# EAGLE design Front_left_lamp_v5 (EAGLE 7.3.0)
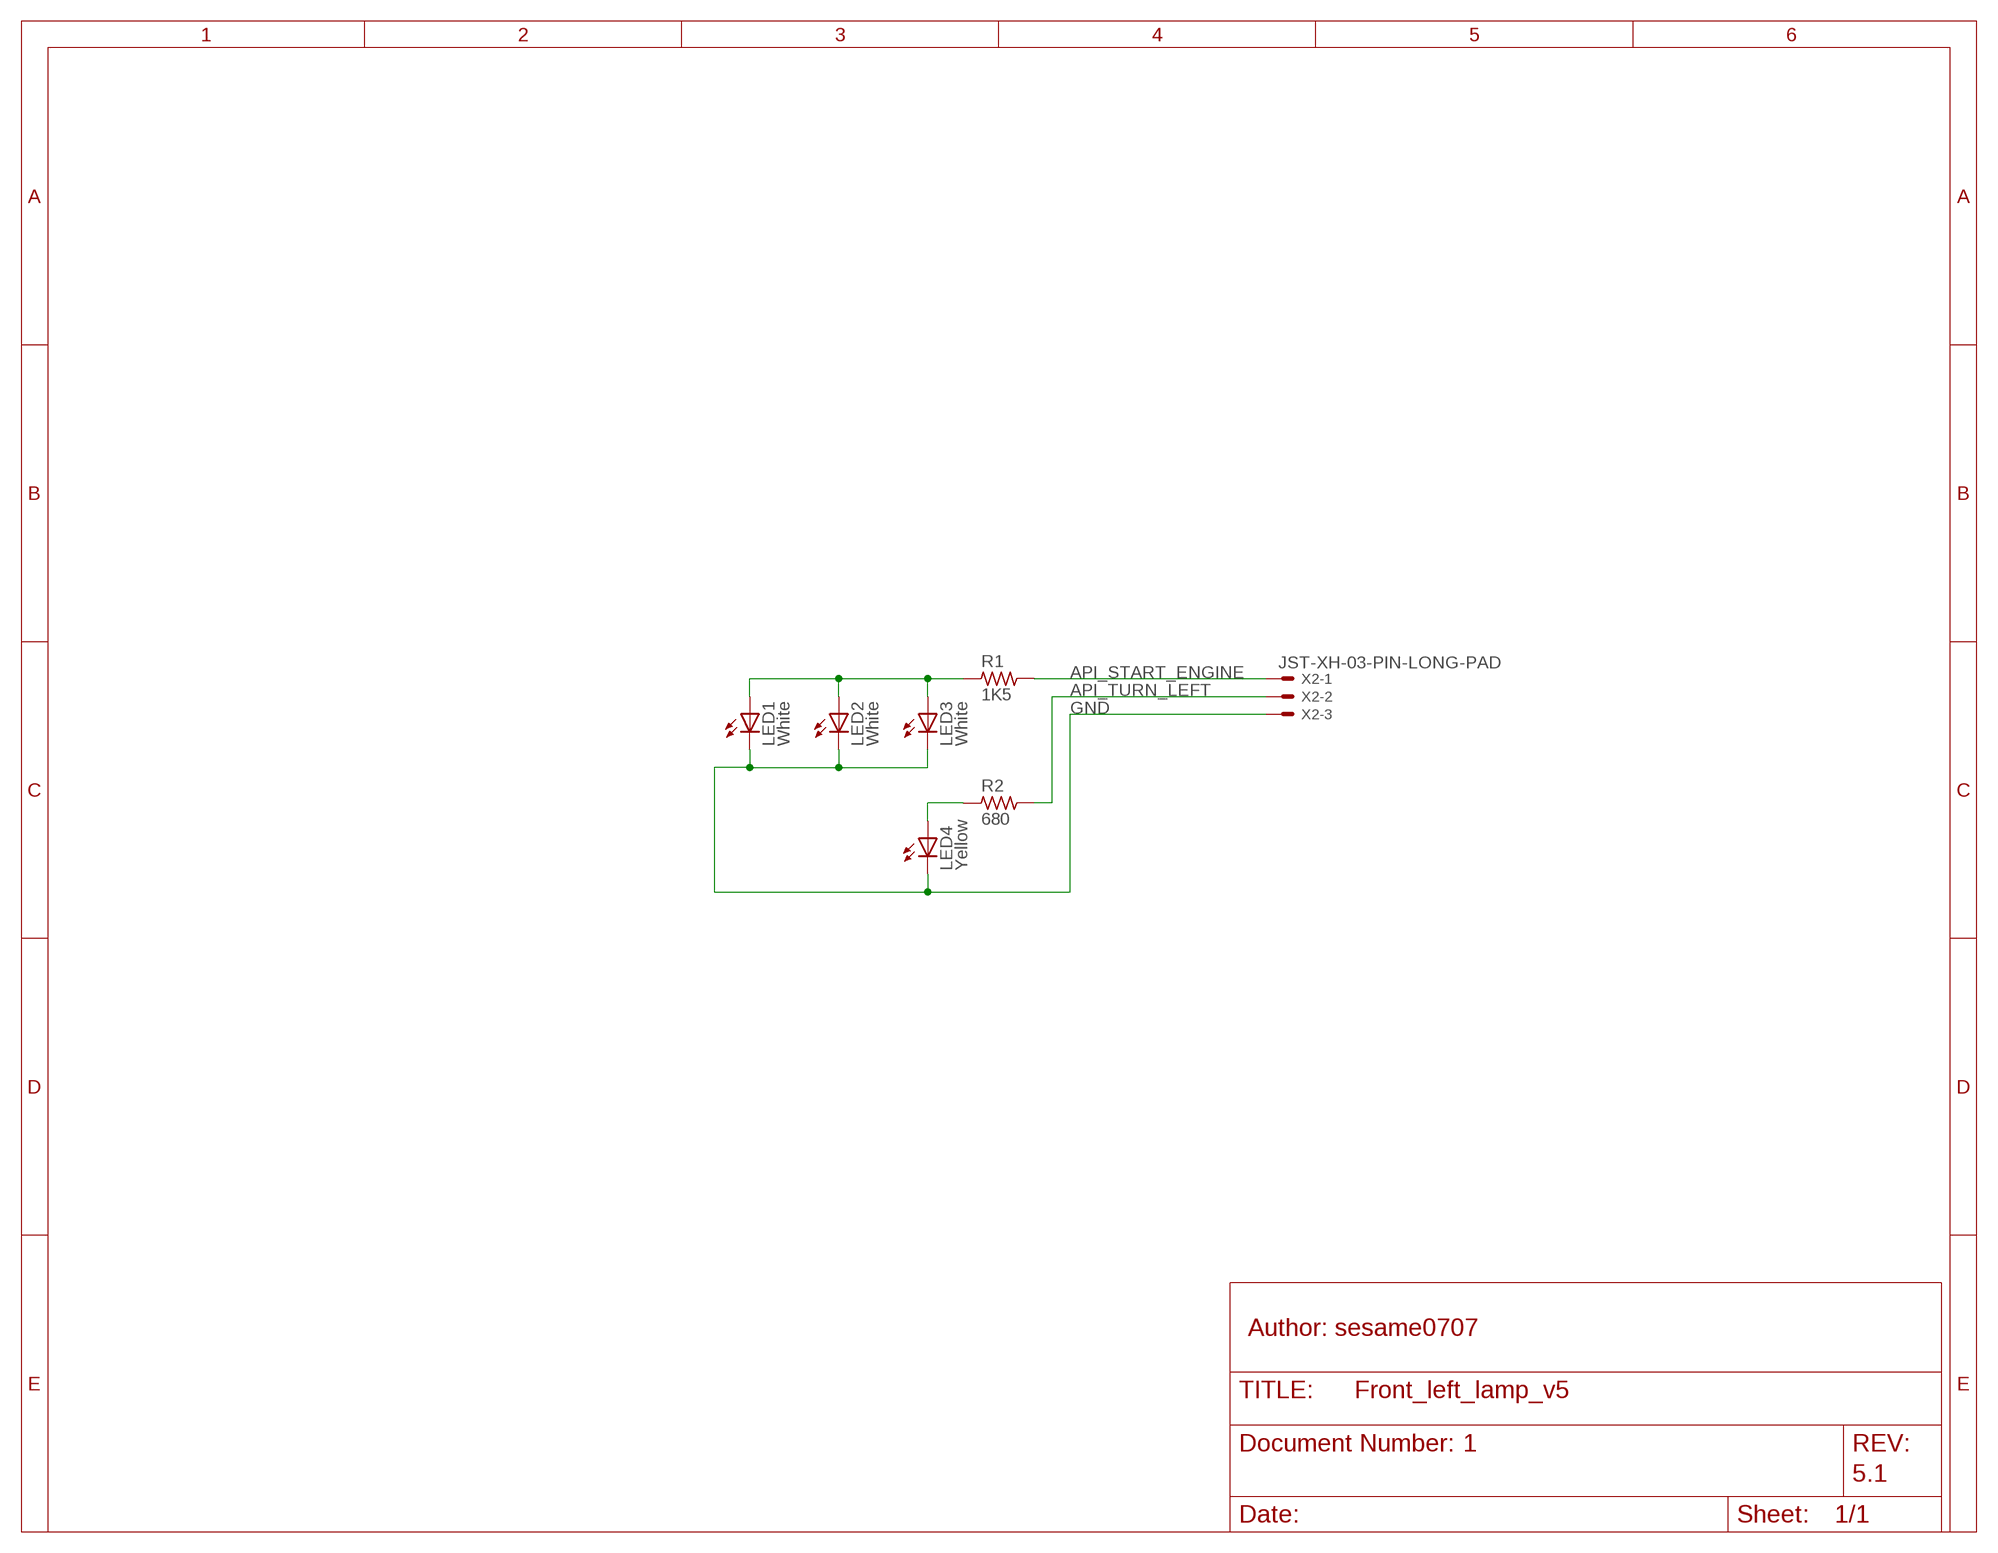
[diagram p0: schematic, sheet 1]

## Parts
LED1  White  LED5MM  [LED5MM]
LED2  White  LED5MM  [LED5MM]
LED3  White  LED5MM  [LED5MM]
LED4  Yellow  LED5MM  [LED5MM]
R1  1K5  R_1206  [R1206]
R2  680  R_1206  [R1206]
X2  JST-XH-03-PIN-LONG-PAD  [JST-XH-03-PACKAGE-LONG-PAD]

## Nets
API_START_ENGINE: LED1.A LED2.A LED3.A R1.1
API_TURN_LEFT: R2.2 X2.2
GND: LED1.K(C) LED2.K(C) LED3.K(C) LED4.K(C) X2.3
N$1: R1.2 X2.1
N$2: LED4.A R2.1

## Notes on the sheet
- Author: sesame0707
- 1
- 5.1

## Library data of the parts
LED1-LED3 = led:LED: LED OSRAM: - CHIPLED LG R971, LG N971, LY N971, LG Q971, LY Q971, LO R971, LY R971 LH N974, LH R974 LS Q976, LO Q976, LY Q976 LO Q996 - Hyper CHIPLED LW Q18S LB Q993, LB Q99A, LB R99A - SideLED LS A670, LO A670, LY A670, LG A670, LP A670 LB A673, LV A673, LT A673, LW A673 LH A674 LY A675 LS A676, LA A676, LO A676, LY A676, LW A676 LS A679, LY A679, LG A679 - Hyper Micro SIDELED® LS Y876, LA Y876, LO Y876, LY Y876 LT Y87S - SmartLED LW L88C, LW L88S LB L89C, LB L89S, LG L890 LS L89K, LO L89K, LY L89K LS L896, LA L896, LO L896, LY L896 - TOPLED LS T670, LO T670, LY T670, LG T670, LP T670 LSG T670, LSP T670, LSY T670, LOP T670, LYG T670 LG T671, LOG T671, LSG T671 LB T673, LV T673, LT T673, LW T673 LH T674 LS T676, LA T676, LO T676, LY T676, LB T676, LH T676, LSB T676, LW T676 LB T67C, LV T67C, LT T67C, LS T67K, LO T67K, LY T67K, LW E67C LS E67B, LA E67B, LO E67B, LY E67B, LB E67C, LV E67C, LT E67C LW T67C LS T679, LY T679, LG T679 LS T770, LO T770, LY T770, LG T770, LP T770 LB T773, LV T773, LT T773, LW T773 LH T774 LS E675, LA E675, LY E675, LS T675 LS T776, LA T776, LO T776, LY T776, LB T776 LHGB T686 LT T68C, LB T68C - Hyper Mini TOPLED® LB M676 - Mini TOPLED Santana® LG M470 LS M47K, LO M47K, LY M47K Source: http://www.osram.convergy.de LUXEON: - LUMILED® LXK2-PW12-R00, LXK2-PW12-S00, LXK2-PW14-U00, LXK2-PW14-V00 LXK2-PM12-R00, LXK2-PM12-S00, LXK2-PM14-U00 LXK2-PE12-Q00, LXK2-PE12-R00, LXK2-PE12-S00, LXK2-PE14-T00, LXK2-PE14-U00 LXK2-PB12-K00, LXK2-PB12-L00, LXK2-PB12-M00, LXK2-PB14-N00, LXK2-PB14-P00, LXK2-PB14-Q00 LXK2-PR12-L00, LXK2-PR12-M00, LXK2-PR14-Q00, LXK2-PR14-R00 LXK2-PD12-Q00, LXK2-PD12-R00, LXK2-PD12-S00 LXK2-PH12-R00, LXK2-PH12-S00 LXK2-PL12-P00, LXK2-PL12-Q00, LXK2-PL12-R00 Source: www.luxeon.com KINGBRIGHT: KA-3528ASYC Source: www.kingbright.com; COLOR: White; CURRENT_EMPIRICAL: 0.14 mA; MANUFACTURER: LUCKYLIGHT; MANUFACTURER_PART_NUMBER: LL-504WC2V-W2-3PD; SUPPLIER: TME; SUPPLIER_PART_NUMBER: LL-504WC2V-W2-3PD; SUPPLIER_URL: https://www.tme.eu/pl/details/ll-504wc2v-w2-3pd/diody-led-tht-okragle/luckylight/; VOLTAGE_EMPIRICAL: 2.58 V
LED4 = led:LED: LED OSRAM: - CHIPLED LG R971, LG N971, LY N971, LG Q971, LY Q971, LO R971, LY R971 LH N974, LH R974 LS Q976, LO Q976, LY Q976 LO Q996 - Hyper CHIPLED LW Q18S LB Q993, LB Q99A, LB R99A - SideLED LS A670, LO A670, LY A670, LG A670, LP A670 LB A673, LV A673, LT A673, LW A673 LH A674 LY A675 LS A676, LA A676, LO A676, LY A676, LW A676 LS A679, LY A679, LG A679 - Hyper Micro SIDELED® LS Y876, LA Y876, LO Y876, LY Y876 LT Y87S - SmartLED LW L88C, LW L88S LB L89C, LB L89S, LG L890 LS L89K, LO L89K, LY L89K LS L896, LA L896, LO L896, LY L896 - TOPLED LS T670, LO T670, LY T670, LG T670, LP T670 LSG T670, LSP T670, LSY T670, LOP T670, LYG T670 LG T671, LOG T671, LSG T671 LB T673, LV T673, LT T673, LW T673 LH T674 LS T676, LA T676, LO T676, LY T676, LB T676, LH T676, LSB T676, LW T676 LB T67C, LV T67C, LT T67C, LS T67K, LO T67K, LY T67K, LW E67C LS E67B, LA E67B, LO E67B, LY E67B, LB E67C, LV E67C, LT E67C LW T67C LS T679, LY T679, LG T679 LS T770, LO T770, LY T770, LG T770, LP T770 LB T773, LV T773, LT T773, LW T773 LH T774 LS E675, LA E675, LY E675, LS T675 LS T776, LA T776, LO T776, LY T776, LB T776 LHGB T686 LT T68C, LB T68C - Hyper Mini TOPLED® LB M676 - Mini TOPLED Santana® LG M470 LS M47K, LO M47K, LY M47K Source: http://www.osram.convergy.de LUXEON: - LUMILED® LXK2-PW12-R00, LXK2-PW12-S00, LXK2-PW14-U00, LXK2-PW14-V00 LXK2-PM12-R00, LXK2-PM12-S00, LXK2-PM14-U00 LXK2-PE12-Q00, LXK2-PE12-R00, LXK2-PE12-S00, LXK2-PE14-T00, LXK2-PE14-U00 LXK2-PB12-K00, LXK2-PB12-L00, LXK2-PB12-M00, LXK2-PB14-N00, LXK2-PB14-P00, LXK2-PB14-Q00 LXK2-PR12-L00, LXK2-PR12-M00, LXK2-PR14-Q00, LXK2-PR14-R00 LXK2-PD12-Q00, LXK2-PD12-R00, LXK2-PD12-S00 LXK2-PH12-R00, LXK2-PH12-S00 LXK2-PL12-P00, LXK2-PL12-Q00, LXK2-PL12-R00 Source: www.luxeon.com KINGBRIGHT: KA-3528ASYC Source: www.kingbright.com; COLOR: Yellow; CURRENT_EMPIRICAL: 1.42 mA; MANUFACTURER: LUCKYLIGHT; MANUFACTURER_PART_NUMBER: LL-503YD2E-1B; SUPPLIER: TME; SUPPLIER_PART_NUMBER: LL-503YD2E-1B; SUPPLIER_URL: https://www.tme.eu/pl/details/ll-503yd2e-1b/diody-led-tht-okragle/luckylight/; VOLTAGE_EMPIRICAL: 1.88 V
R1 = rc-master-smd:R_: RESISTOR; MANUFACTURER: ROYAL OHM; MANUFACTURER_PART_NUMBER: 1206S4J0152T5E; RESISTANCE: 1.5 kOhm; SUPPLIER: TME; SUPPLIER_PART_NUMBER: 1206S4J0152T5E; SUPPLIER_URL: https://www.tme.eu/pl/details/1206s4j0152t5e/rezystory-smd/royal-ohm/
R2 = rc-master-smd:R_: RESISTOR; MANUFACTURER: ROYAL OHM; MANUFACTURER_PART_NUMBER: 1206S4J0681T5E; RESISTANCE: 680 Ohm; SUPPLIER: TME; SUPPLIER_PART_NUMBER: 1206S4J0681T5E; SUPPLIER_URL: https://www.tme.eu/pl/details/1206s4j0681t5e/rezystory-smd/royal-ohm/
X2 = Rembrandt Electronics - JST XH Connectors v1-0:JST-XH-03-PIN: JST XH Connector 2 Pin Wire to board connector. Pitch: 2,54 mm, (0.100") Number of pins: 3 Created by Rembrandt Electronics www.rembrandtelectronics.com

## Board
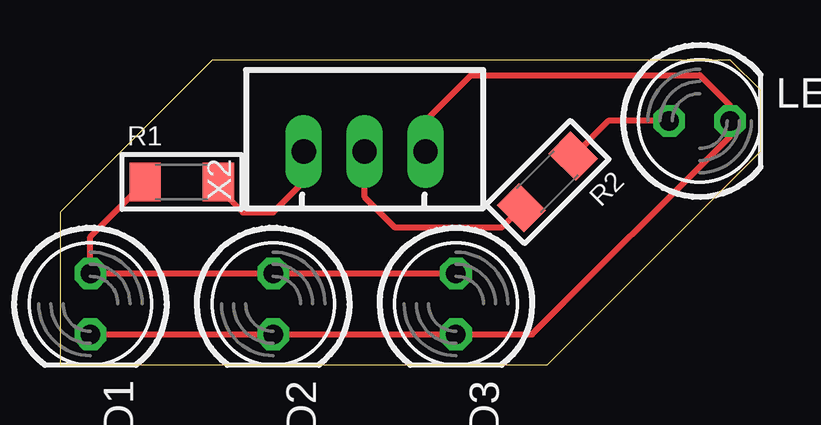
[diagram p1: board, top side]

Size 29.21 x 12.7 mm. Coordinates in mm from the lower left corner, seen from the top.
Outline: 27.94,12.7 6.35,12.7 0,6.35 0,0 20.32,0 29.21,8.89 29.21,11.43 27.94,12.7
Copper layers (1*16): Top 0.035mm / dielectric 1.5mm / Bottom 0.035mm
Design rules "default": minimum track width 10mil, minimum drill 24mil, track to track 8mil, track to pad 8mil, pad to pad 8mil, via to via 8mil, smd to smd 8mil, copper to edge 40mil, drill to drill 8mil, minimum pad ring 10mil, minimum via ring 8mil, stop-mask expansion 4mil, vias tented up to drill 0mil, thermal gap 10mil

### Footprints (pad centres in the part's own frame; a part is rotated, then mirrored left to right if it is on the bottom)
LED5MM = drill 0.813 octagon: A -1.27,0; K 1.27,0
R1206 = smd 1.3 x 1.6: 1 -1.524,0; 2 1.524,0
JST-XH-03-PACKAGE-LONG-PAD = drill 1.016 long: 1 -2.54,0; 2 0,0; 3 2.54,0

### Placement (x,y rotation side)
LED1  1.27,2.54 270 top
LED2  8.89,2.54 270 top
LED3  16.51,2.54 270 top
LED4  26.67,10.16 0 top
R1  5.08,7.62 0 top
R2  20.32,7.62 225 top
X2  12.7,8.89 0 top

### Tracks (layer width: path | path; a pad name or v marks a point on that pad's centre or on a via)
API_START_ENGINE
  Top 0.254: R1.1 1.27,5.33 LED1.A LED2.A LED3.A
API_TURN_LEFT
  Top 0.254: X2.2 12.7,6.99 13.97,5.71 18.41,5.71 R2.2
GND
  Top 0.254: X2.3 15.24,10.16 17.14,12.06 26.67,12.06 27.94,10.79 LED4.K 27.94,9.53 19.68,1.27 LED3.K LED2.K LED1.K
N$1
  Top 0.254: R1.2 6.6,7.37 7.62,6.35 8.89,6.35 10.16,7.62 X2.1
N$2
  Top 0.254: LED4.A 22.86,10.16 R2.1